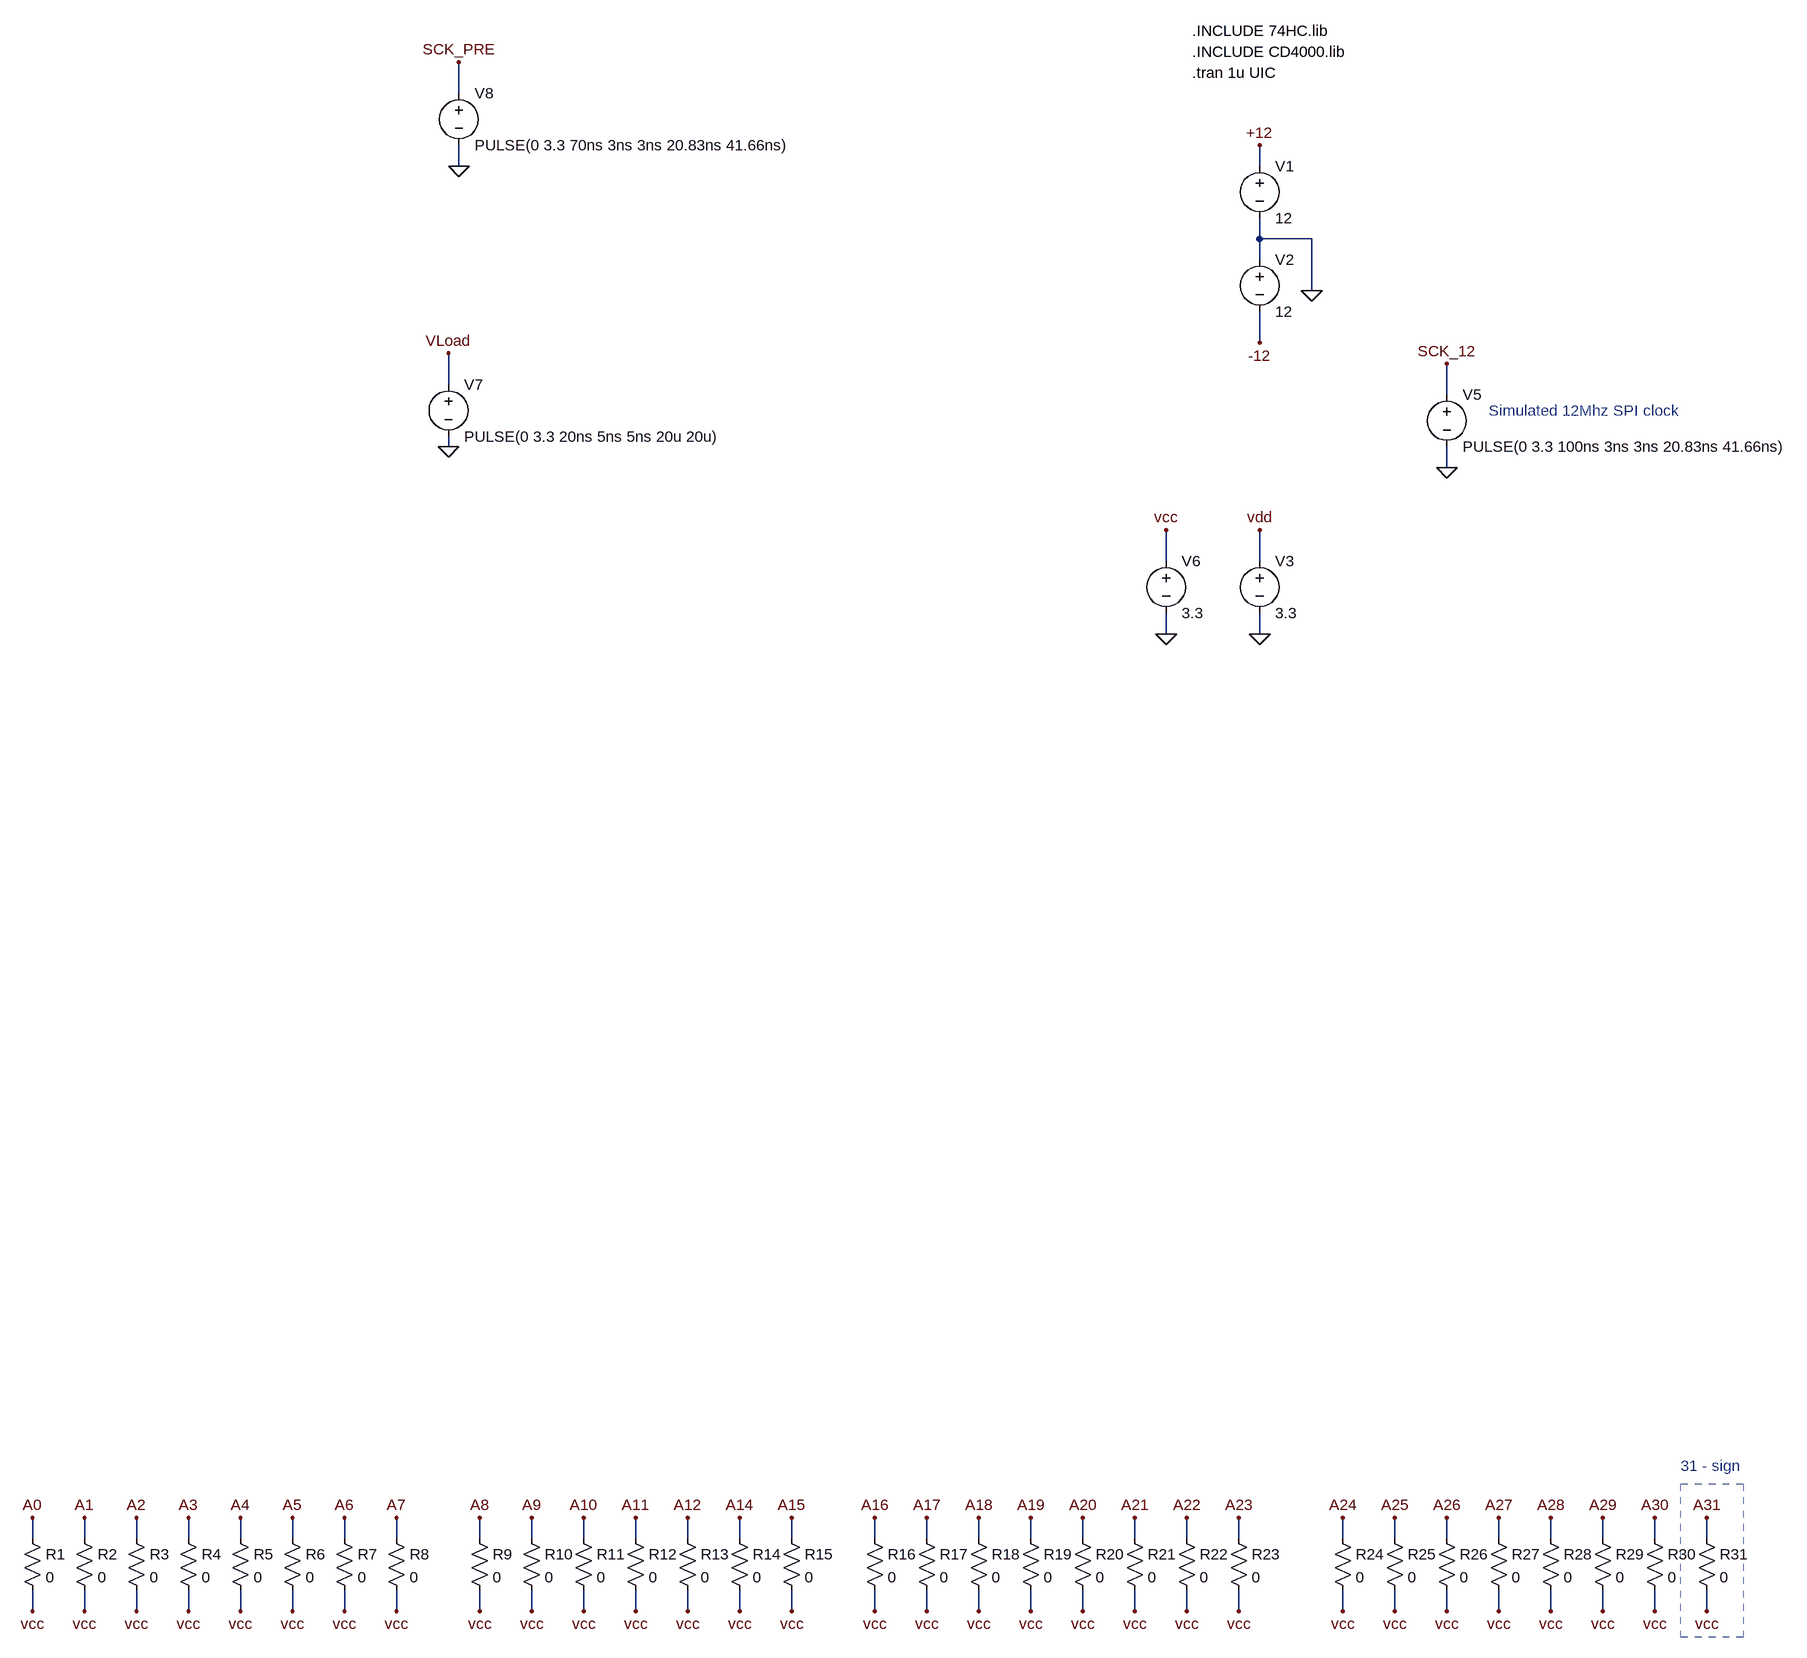
[diagram p0: schematic FloatAdder.asc]
FloatAdder.asc, the LTspice schematic file:
Version 4
SHEET 1 3368 3520
WIRE -1168 144 -1168 96
WIRE -1168 256 -1168 224
WIRE 64 256 64 224
WIRE 64 368 64 336
WIRE 144 368 64 368
WIRE 64 400 64 368
WIRE 144 448 144 368
WIRE 64 528 64 480
WIRE -1184 592 -1184 544
WIRE 352 608 352 560
WIRE -1184 688 -1184 672
WIRE 352 720 352 688
WIRE -80 864 -80 816
WIRE 64 864 64 816
WIRE -80 976 -80 944
WIRE 64 976 64 944
WIRE -1824 2368 -1824 2336
WIRE -1744 2368 -1744 2336
WIRE -1664 2368 -1664 2336
WIRE -1584 2368 -1584 2336
WIRE -1504 2368 -1504 2336
WIRE -1424 2368 -1424 2336
WIRE -1344 2368 -1344 2336
WIRE -1264 2368 -1264 2336
WIRE -1136 2368 -1136 2336
WIRE -1056 2368 -1056 2336
WIRE -976 2368 -976 2336
WIRE -896 2368 -896 2336
WIRE -816 2368 -816 2336
WIRE -736 2368 -736 2336
WIRE -656 2368 -656 2336
WIRE -528 2368 -528 2336
WIRE -448 2368 -448 2336
WIRE -368 2368 -368 2336
WIRE -288 2368 -288 2336
WIRE -208 2368 -208 2336
WIRE -128 2368 -128 2336
WIRE -48 2368 -48 2336
WIRE 32 2368 32 2336
WIRE 192 2368 192 2336
WIRE 272 2368 272 2336
WIRE 352 2368 352 2336
WIRE 432 2368 432 2336
WIRE 512 2368 512 2336
WIRE 592 2368 592 2336
WIRE 672 2368 672 2336
WIRE 752 2368 752 2336
WIRE -1824 2480 -1824 2448
WIRE -1744 2480 -1744 2448
WIRE -1664 2480 -1664 2448
WIRE -1584 2480 -1584 2448
WIRE -1504 2480 -1504 2448
WIRE -1424 2480 -1424 2448
WIRE -1344 2480 -1344 2448
WIRE -1264 2480 -1264 2448
WIRE -1136 2480 -1136 2448
WIRE -1056 2480 -1056 2448
WIRE -976 2480 -976 2448
WIRE -896 2480 -896 2448
WIRE -816 2480 -816 2448
WIRE -736 2480 -736 2448
WIRE -656 2480 -656 2448
WIRE -528 2480 -528 2448
WIRE -448 2480 -448 2448
WIRE -368 2480 -368 2448
WIRE -288 2480 -288 2448
WIRE -208 2480 -208 2448
WIRE -128 2480 -128 2448
WIRE -48 2480 -48 2448
WIRE 32 2480 32 2448
WIRE 192 2480 192 2448
WIRE 272 2480 272 2448
WIRE 352 2480 352 2448
WIRE 432 2480 432 2448
WIRE 512 2480 512 2448
WIRE 592 2480 592 2448
WIRE 672 2480 672 2448
WIRE 752 2480 752 2448
FLAG 64 224 +12
FLAG 64 528 -12
FLAG 144 448 0
FLAG 64 816 vdd
FLAG 64 976 0
FLAG 352 560 SCK_12
FLAG 352 720 0
FLAG -80 816 vcc
FLAG -80 976 0
FLAG -1184 688 0
FLAG -1184 544 VLoad
FLAG -1168 96 SCK_PRE
FLAG -1168 256 0
FLAG -1824 2336 A0
FLAG -1824 2480 vcc
FLAG -1744 2336 A1
FLAG -1744 2480 vcc
FLAG -1664 2336 A2
FLAG -1664 2480 vcc
FLAG -1584 2336 A3
FLAG -1584 2480 vcc
FLAG -1504 2336 A4
FLAG -1504 2480 vcc
FLAG -1424 2336 A5
FLAG -1424 2480 vcc
FLAG -1344 2336 A6
FLAG -1344 2480 vcc
FLAG -1264 2336 A7
FLAG -1264 2480 vcc
FLAG -1136 2336 A8
FLAG -1136 2480 vcc
FLAG -1056 2336 A9
FLAG -1056 2480 vcc
FLAG -976 2336 A10
FLAG -976 2480 vcc
FLAG -896 2336 A11
FLAG -896 2480 vcc
FLAG -816 2336 A12
FLAG -816 2480 vcc
FLAG -736 2336 A14
FLAG -736 2480 vcc
FLAG -656 2336 A15
FLAG -656 2480 vcc
FLAG -528 2336 A16
FLAG -528 2480 vcc
FLAG -448 2336 A17
FLAG -448 2480 vcc
FLAG -368 2336 A18
FLAG -368 2480 vcc
FLAG -288 2336 A19
FLAG -288 2480 vcc
FLAG -208 2336 A20
FLAG -208 2480 vcc
FLAG -128 2336 A21
FLAG -128 2480 vcc
FLAG -48 2336 A22
FLAG -48 2480 vcc
FLAG 32 2336 A23
FLAG 32 2480 vcc
FLAG 192 2336 A24
FLAG 192 2480 vcc
FLAG 272 2336 A25
FLAG 272 2480 vcc
FLAG 352 2336 A26
FLAG 352 2480 vcc
FLAG 432 2336 A27
FLAG 432 2480 vcc
FLAG 512 2336 A28
FLAG 512 2480 vcc
FLAG 592 2336 A29
FLAG 592 2480 vcc
FLAG 672 2336 A30
FLAG 672 2480 vcc
FLAG 752 2336 A31
FLAG 752 2480 vcc
SYMBOL voltage 64 240 R0
SYMATTR InstName V1
SYMATTR Value 12
SYMBOL voltage 64 384 R0
SYMATTR InstName V2
SYMATTR Value 12
SYMBOL voltage 64 848 R0
SYMATTR InstName V3
SYMATTR Value 3.3
SYMBOL voltage 352 592 R0
SYMATTR InstName V5
SYMATTR Value PULSE(0 3.3 100ns 3ns 3ns 20.83ns 41.66ns)
SYMBOL voltage -80 848 R0
SYMATTR InstName V6
SYMATTR Value 3.3
SYMBOL voltage -1184 576 R0
SYMATTR InstName V7
SYMATTR Value PULSE(0 3.3 20ns 5ns 5ns 20u 20u)
SYMBOL voltage -1168 128 R0
SYMATTR InstName V8
SYMATTR Value PULSE(0 3.3 70ns 3ns 3ns 20.83ns 41.66ns)
SYMBOL res -1840 2352 R0
SYMATTR InstName R1
SYMATTR Value 0
SYMBOL res -1760 2352 R0
SYMATTR InstName R2
SYMATTR Value 0
SYMBOL res -1680 2352 R0
SYMATTR InstName R3
SYMATTR Value 0
SYMBOL res -1600 2352 R0
SYMATTR InstName R4
SYMATTR Value 0
SYMBOL res -1520 2352 R0
SYMATTR InstName R5
SYMATTR Value 0
SYMBOL res -1440 2352 R0
SYMATTR InstName R6
SYMATTR Value 0
SYMBOL res -1360 2352 R0
SYMATTR InstName R7
SYMATTR Value 0
SYMBOL res -1280 2352 R0
SYMATTR InstName R8
SYMATTR Value 0
SYMBOL res -1152 2352 R0
SYMATTR InstName R9
SYMATTR Value 0
SYMBOL res -1072 2352 R0
SYMATTR InstName R10
SYMATTR Value 0
SYMBOL res -992 2352 R0
SYMATTR InstName R11
SYMATTR Value 0
SYMBOL res -912 2352 R0
SYMATTR InstName R12
SYMATTR Value 0
SYMBOL res -832 2352 R0
SYMATTR InstName R13
SYMATTR Value 0
SYMBOL res -752 2352 R0
SYMATTR InstName R14
SYMATTR Value 0
SYMBOL res -672 2352 R0
SYMATTR InstName R15
SYMATTR Value 0
SYMBOL res -544 2352 R0
SYMATTR InstName R16
SYMATTR Value 0
SYMBOL res -464 2352 R0
SYMATTR InstName R17
SYMATTR Value 0
SYMBOL res -384 2352 R0
SYMATTR InstName R18
SYMATTR Value 0
SYMBOL res -304 2352 R0
SYMATTR InstName R19
SYMATTR Value 0
SYMBOL res -224 2352 R0
SYMATTR InstName R20
SYMATTR Value 0
SYMBOL res -144 2352 R0
SYMATTR InstName R21
SYMATTR Value 0
SYMBOL res -64 2352 R0
SYMATTR InstName R22
SYMATTR Value 0
SYMBOL res 16 2352 R0
SYMATTR InstName R23
SYMATTR Value 0
SYMBOL res 176 2352 R0
SYMATTR InstName R24
SYMATTR Value 0
SYMBOL res 256 2352 R0
SYMATTR InstName R25
SYMATTR Value 0
SYMBOL res 336 2352 R0
SYMATTR InstName R26
SYMATTR Value 0
SYMBOL res 416 2352 R0
SYMATTR InstName R27
SYMATTR Value 0
SYMBOL res 496 2352 R0
SYMATTR InstName R28
SYMATTR Value 0
SYMBOL res 576 2352 R0
SYMATTR InstName R29
SYMATTR Value 0
SYMBOL res 656 2352 R0
SYMATTR InstName R30
SYMATTR Value 0
SYMBOL res 736 2352 R0
SYMATTR InstName R31
SYMATTR Value 0
TEXT -40 112 Left 2 !.tran 1u UIC
TEXT 416 632 Left 2 ;Simulated 12Mhz SPI clock
TEXT -40 80 Left 2 !.INCLUDE CD4000.lib
TEXT -40 48 Left 2 !.INCLUDE 74HC.lib
TEXT 712 2256 Left 2 ;31 - sign
RECTANGLE Normal 712 2284 808 2520 2

The netlist it stands for:
* FloatAdder.asc
V1 +12 0 12
V2 0 -12 12
V3 vdd 0 3.3
V5 SCK_12 0 PULSE(0 3.3 100ns 3ns 3ns 20.83ns 41.66ns)
V6 vcc 0 3.3
V7 VLoad 0 PULSE(0 3.3 20ns 5ns 5ns 20u 20u)
V8 SCK_PRE 0 PULSE(0 3.3 70ns 3ns 3ns 20.83ns 41.66ns)
R1 A0 vcc 0
R2 A1 vcc 0
R3 A2 vcc 0
R4 A3 vcc 0
R5 A4 vcc 0
R6 A5 vcc 0
R7 A6 vcc 0
R8 A7 vcc 0
R9 A8 vcc 0
R10 A9 vcc 0
R11 A10 vcc 0
R12 A11 vcc 0
R13 A12 vcc 0
R14 A14 vcc 0
R15 A15 vcc 0
R16 A16 vcc 0
R17 A17 vcc 0
R18 A18 vcc 0
R19 A19 vcc 0
R20 A20 vcc 0
R21 A21 vcc 0
R22 A22 vcc 0
R23 A23 vcc 0
R24 A24 vcc 0
R25 A25 vcc 0
R26 A26 vcc 0
R27 A27 vcc 0
R28 A28 vcc 0
R29 A29 vcc 0
R30 A30 vcc 0
R31 A31 vcc 0
.tran 1u UIC
* Simulated 12Mhz SPI clock
.INCLUDE CD4000.lib
.INCLUDE 74HC.lib
* 31 - sign
.backanno
.end